# EAGLE design power_board_ups_only (EAGLE 5.10)
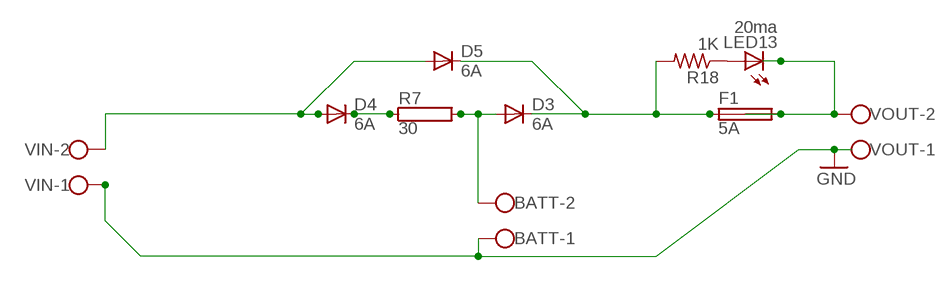
[diagram p0: schematic, sheet 1]

## Parts
BATT  W237-102  [W237-102]
D3  6A  DIODE-P6-15  [P6-15]
D4  6A  DIODE-P6-15  [P6-15]
D5  6A  DIODE-P6-15  [P6-15]
F1  5A  SHK20Q  [SHK20Q]
LED13  20ma  LED5MM  [LED5MM]
R7  30  RRS05_69-70  [RS05_69-70]
R18  1K  R-US_0207/10  [0207/10]
VIN  W237-102  [W237-102]
VOUT  W237-102  [W237-102]

## Nets
GND3: BATT.1 VIN.1 VOUT.1 ; supply symbol labelled GND
N100: D3.C D5.C F1.1A R18.2
N$2: BATT.2 D3.A R7.2
N$6: F1.2A F1.2B LED13.K(C) VOUT.2
N$10: D4.C R7.1
N$11: D4.A D5.A VIN.2
N$67: LED13.A R18.1
Unconnected: F1.1B

## Library data of the parts
BATT VIN VOUT = con-wago-500:W237-102: WAGO SCREW CLAMP
D3-D5 = diode:DIODE-: DIODE
F1 = Arduino-23B:SHK20Q: FUSE HOLDER 5 x 20 mm, SH contact, E1207 Buerklin 64G6061
LED13 = adafruit:LED: LED OSRAM: - CHIPLED LG R971, LG N971, LY N971, LG Q971, LY Q971, LO R971, LY R971 LH N974, LH R974 LS Q976, LO Q976, LY Q976 LO Q996 - Hyper CHIPLED LW Q18S LB Q993, LB Q99A, LB R99A - SideLED LS A670, LO A670, LY A670, LG A670, LP A670 LB A673, LV A673, LT A673, LW A673 LH A674 LY A675 LS A676, LA A676, LO A676, LY A676, LW A676 LS A679, LY A679, LG A679 - Hyper Micro SIDELED® LS Y876, LA Y876, LO Y876, LY Y876 LT Y87S - SmartLED LW L88C, LW L88S LB L89C, LB L89S, LG L890 LS L89K, LO L89K, LY L89K LS L896, LA L896, LO L896, LY L896 - TOPLED LS T670, LO T670, LY T670, LG T670, LP T670 LSG T670, LSP T670, LSY T670, LOP T670, LYG T670 LG T671, LOG T671, LSG T671 LB T673, LV T673, LT T673, LW T673 LH T674 LS T676, LA T676, LO T676, LY T676, LB T676, LH T676, LSB T676, LW T676 LB T67C, LV T67C, LT T67C, LS T67K, LO T67K, LY T67K, LW E67C LS E67B, LA E67B, LO E67B, LY E67B, LB E67C, LV E67C, LT E67C LW T67C LS T679, LY T679, LG T679 LS T770, LO T770, LY T770, LG T770, LP T770 LB T773, LV T773, LT T773, LW T773 LH T774 LS E675, LA E675, LY E675, LS T675 LS T776, LA T776, LO T776, LY T776, LB T776 LHGB T686 LT T68C, LB T68C - Hyper Mini TOPLED® LB M676 - Mini TOPLED Santana® LG M470 LS M47K, LO M47K, LY M47K Source: http://www.osram.convergy.de/
R7 = resistor-power:R: Power Resitor
R18 = resistor:R-US_: RESISTOR, American symbol

## Board
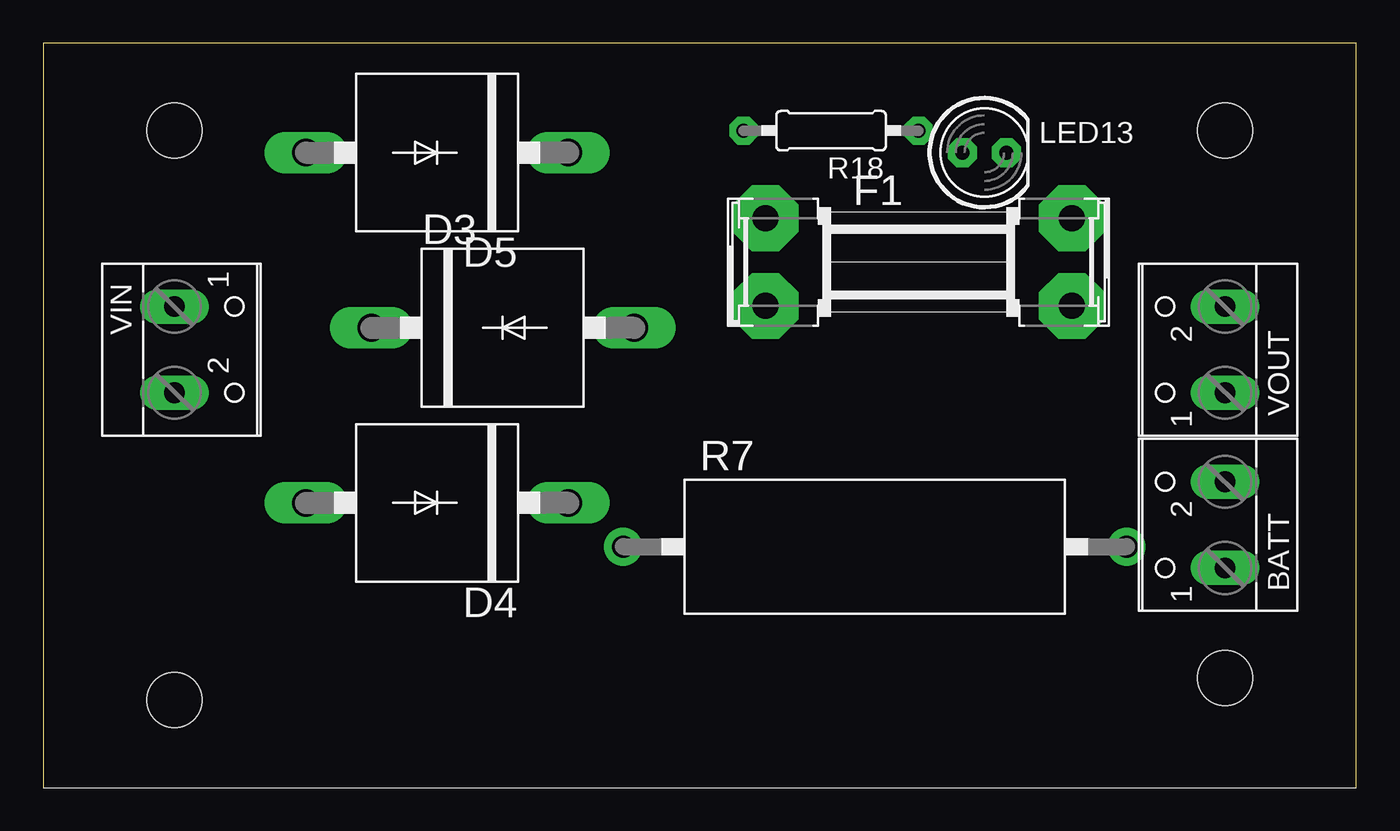
[diagram p1: board, top side]
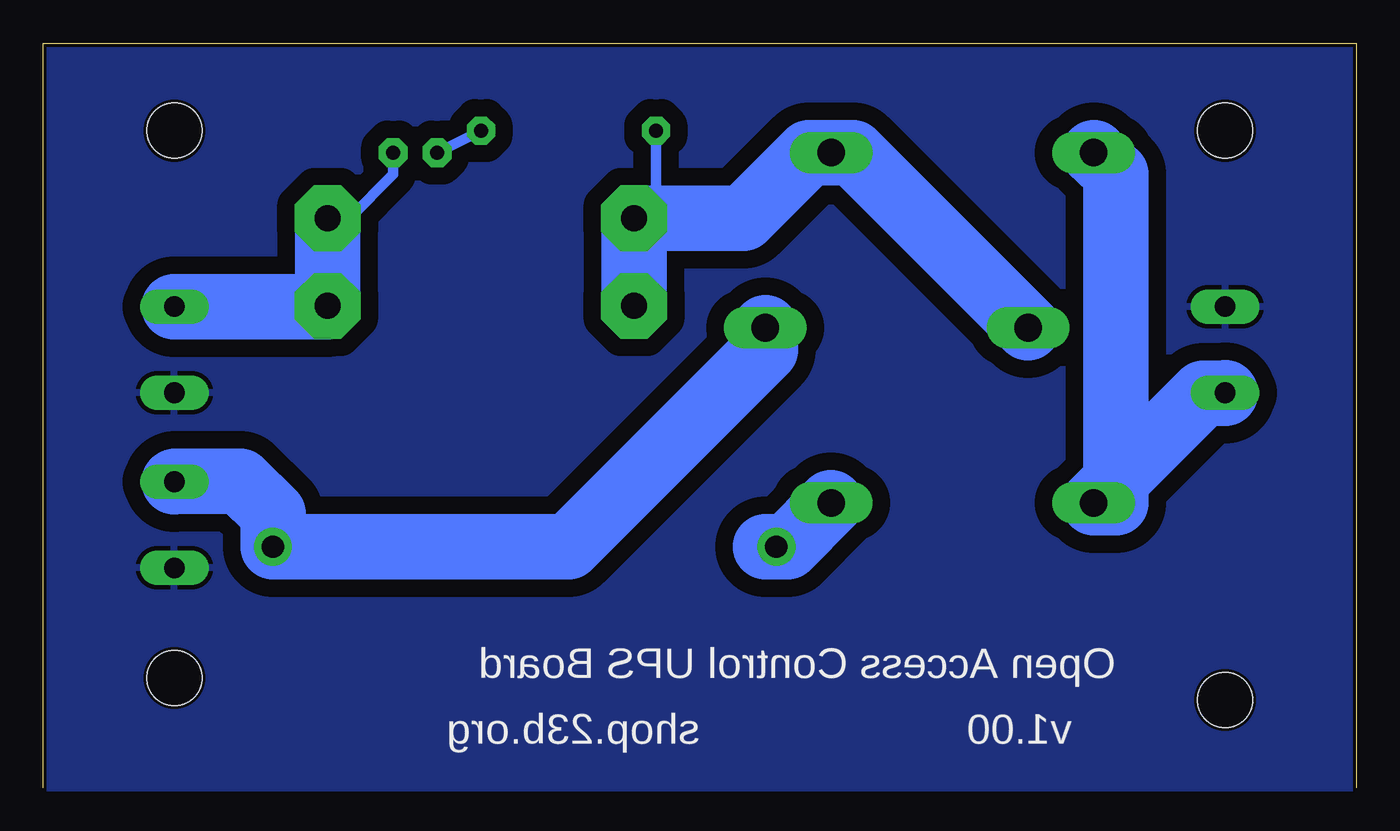
[diagram p2: board, bottom side, seen from below]

Size 76.2 x 43.18 mm. Coordinates in mm from the lower left corner, seen from the top.
Outline: 76.2,0 76.2,43.18 0,43.18 0,0
Copper layers (1*16): Top 0.035mm / dielectric 1.5mm / Bottom 0.035mm
Design rules "FabinABox": minimum track width 16mil, minimum drill 25mil, track to track 40mil, track to pad 36mil, pad to pad 32mil, via to via 32mil, smd to smd 32mil, copper to edge 8mil, drill to drill 30mil, minimum pad ring 16mil, minimum via ring 16mil, stop-mask expansion 4mil, vias tented up to drill 25mil, thermal gap 10mil
Holes 3.17 mm at 7.62,38.1 68.58,38.1 68.58,6.35 7.62,5.08

### Footprints (pad centres in the part's own frame; a part is rotated, then mirrored left to right if it is on the bottom)
W237-102 = drill 1.194 long: 1 -2.5,-1.27; 2 2.5,-1.27
P6-15 = drill 1.6 long: A 7.62,0; C -7.62,0
SHK20Q = drill 1.5 pad 3.81 octagon: 1A -8.89,2.54; 1B -8.89,-2.54; 2A 8.89,2.54; 2B 8.89,-2.54
LED5MM = drill 0.813 pad 1.676 octagon: A -1.27,0; K 1.27,0
RS05_69-70 = drill 1.3 pad 2.2 round: 1 -14.605,0; 2 14.605,0
0207/10 = drill 0.813 octagon: 1 -5.08,0; 2 5.08,0

### Placement (x,y rotation side)
BATT  67.31,15.24 90 top
D3  26.67,26.67 0 top
D4  22.86,16.51 180 top
D5  22.86,36.83 180 top
F1  50.8,30.48 0 top
LED13  54.61,36.83 0 top
R7  48.26,13.97 0 top
R18  45.72,38.1 180 top
VIN  8.89,25.4 270 top
VOUT  67.31,25.4 90 top

### Tracks (layer width: path | path; a pad name or v marks a point on that pad's centre or on a via)
GND3
  pour Bottom: 0,43.18 76.2,43.18 76.2,0 0,0
N100
  Bottom 0.61: R18.2 40.64,34.29 F1.1A
  Bottom 3.81: D3.C 29.21,36.83 D5.C | D5.C 31.75,36.83 | F1.1A 41.91,27.94 F1.1A | F1.1A 35.56,33.02 31.75,36.83 | D5.C 31.75,36.83
N$2
  Bottom 3.81: D3.A 34.29,25.4 45.72,13.97 R7.2 62.87,15.88 64.77,17.78 68.54,17.78 BATT.2
N$6
  Bottom 0.61: LED13.K 55.88,35.56 58.42,33.02 F1.2A
  Bottom 3.81: VOUT.2 59.73,27.9 F1.2B F1.2A
N$10
  Bottom 3.81: D4.C 33.02,13.97 | 33.02,13.97 R7.1 | R7.1 34.29,13.97 | R7.1 33.02,13.97
N$11
  Bottom 3.81: D5.A 13.97,35.56 13.97,16.51 D4.A 8.89,22.86 7.62,22.86 VIN.2
N$67
  Bottom 0.61: LED13.A R18.1

### Text on the board
bPlace: Open Access Control UPS Board | v1.00 | shop.23b.org